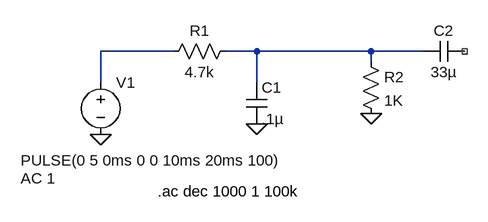
[diagram p0: schematic 542B-tone-generator.asc]
542B-tone-generator.asc, the LTspice schematic file:
Version 4
SHEET 1 880 680
WIRE 128 80 16 80
WIRE 256 80 208 80
WIRE 432 80 256 80
WIRE 512 80 432 80
WIRE 432 96 432 80
WIRE 16 128 16 80
WIRE 256 128 256 80
FLAG 16 208 0
FLAG 256 192 0
FLAG 432 176 0
SYMBOL voltage 16 112 R0
WINDOW 3 -123 136 Left 2
WINDOW 123 -123 164 Left 2
WINDOW 39 0 0 Left 0
SYMATTR InstName V1
SYMATTR Value PULSE(0 5 0ms 0 0 10ms 20ms 100)
SYMATTR Value2 AC 1
SYMBOL res 224 64 R90
WINDOW 0 0 56 VBottom 2
WINDOW 3 32 56 VTop 2
SYMATTR InstName R1
SYMATTR Value 4.7k
SYMBOL cap 240 128 R0
SYMATTR InstName C1
SYMATTR Value .1µ
SYMBOL res 416 80 R0
SYMATTR InstName R2
SYMATTR Value 1K
SYMBOL cap 576 64 R90
WINDOW 0 0 32 VBottom 2
WINDOW 3 32 32 VTop 2
SYMATTR InstName C2
SYMATTR Value 33µ
TEXT 104 296 Left 2 !.ac dec 1000 1 100k

The netlist it stands for:
* 542B-tone-generator.asc
V1 N001 0 PULSE(0 5 0ms 0 0 10ms 20ms 100) AC 1
R1 N002 N001 4.7k
C1 N002 0 .1µ
R2 N002 0 1K
C2 NC_01 N002 33µ
.ac dec 1000 1 100k
.backanno
.end